# Altium schematic sheet Battery.SchDoc
size A4
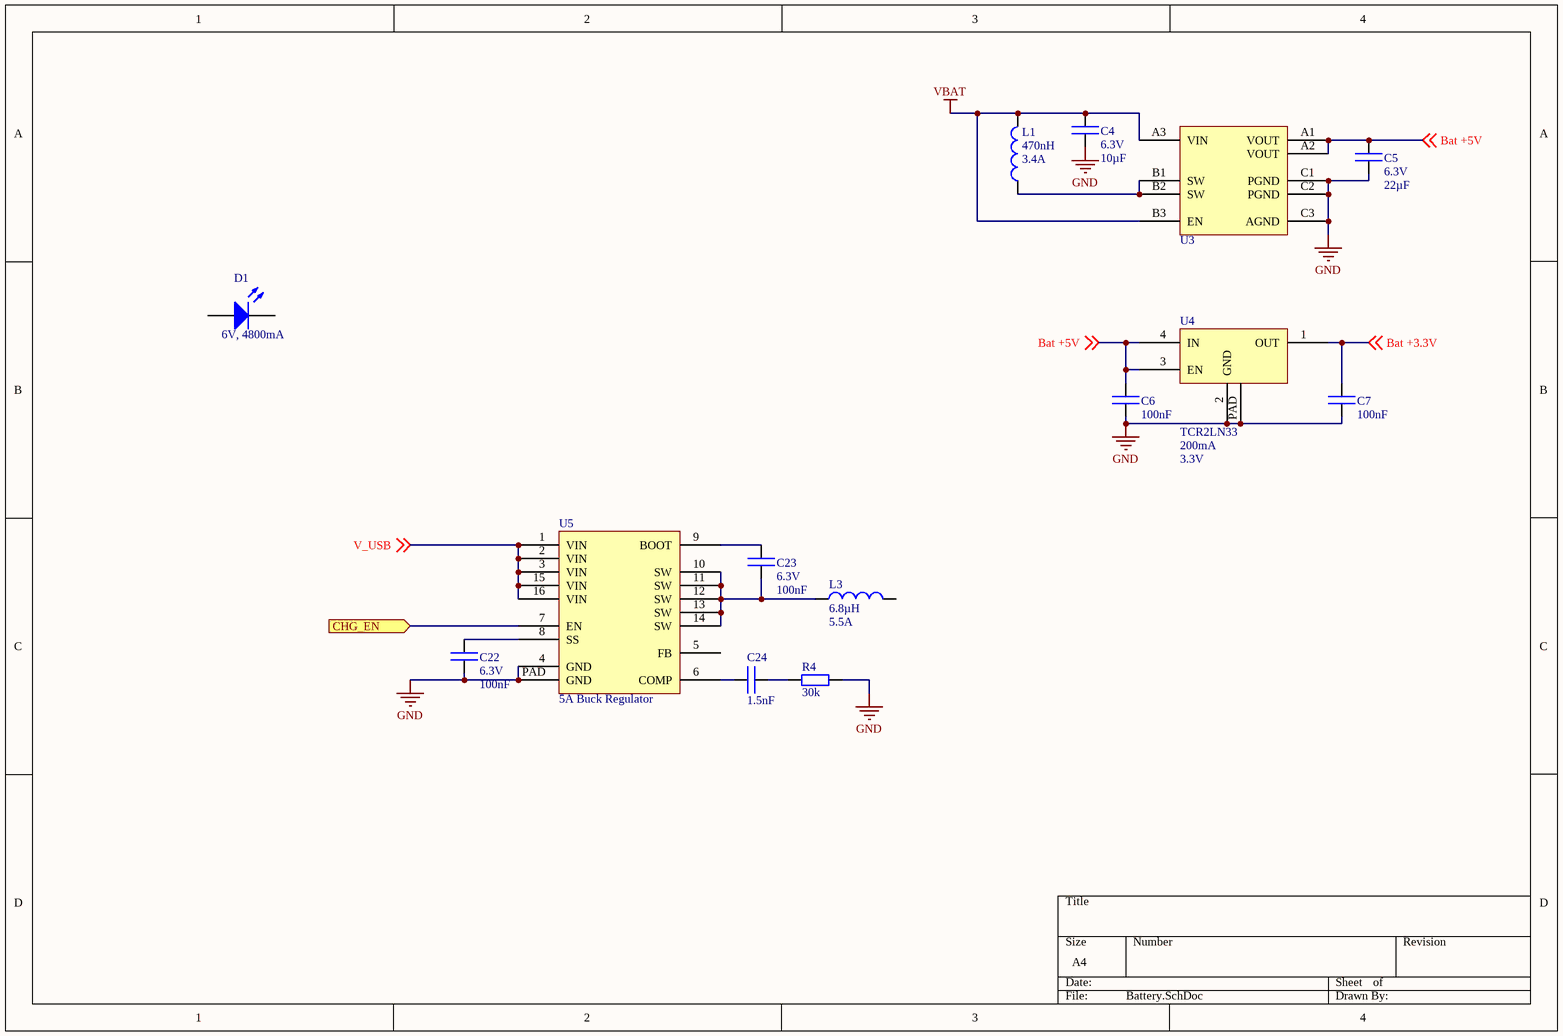
[diagram p0: Battery.SchDoc]

## Parts
C4  Voltage: 6.3V  Capacity: 10µF  [0402 (C)]  (hidden comment: Cap 10µF)
C5  VOLTAGE: 6.3V  CAPACITY: 22µF  [0603 (C)]  (hidden comment: Cap 22µF)
C6  Capacity: 100nF  [0201 (C)]  (hidden comment: Cap 100nF)
C7  Capacity: 100nF  [0201 (C)]  (hidden comment: Cap 100nF)
C22  Voltage: 6.3V  Capacity: 100nF  [0201 (C)]  (hidden comment: Cap 100nF)
C23  Voltage: 6.3V  Capacity: 100nF  [0201 (C)]  (hidden comment: Cap 100nF)
C24  Capacity: 1.5nF  [0201 (C)]  (hidden comment: Cap 1.5nF)
D1  specs: 6V, 4800mA  [XHP70 6V Slot]  (hidden comment: XHP70)
L1  value 470nH  Current: 3.4A  [0806 (L)]  (hidden comment: L 470nH)
L3  value 6.8µH  Rated Current: 5.5A  [Inductor (8.4mm x 7.9mm)]  (hidden comment: L 6.8µH)
R4  value 30k  [0603 (R)]  (hidden comment: Res 30k)
U3  FAN48610UC50X  [WLCSP-6 (1.2mm x 1.2mm)]  (value not drawn)
U4  TCR2LN33  Current: 200mA  Output Voltage: 3.3V  [SDFN-4 (0.8mm x 0.8mm)]
U5  5A Buck Regulator  [WQFN-16 (3mm x 3mm)]

## Ports
CHG_EN (in)

## Nets
GND: C4.2 C5.2 C6.2 C7.2 C22.1 R4.2 U3.C1(PGND) U3.C2(PGND) U3.C3(AGND) U4.2(GND) U4.PAD U5.4(GND) U5.PAD(GND)
VBAT: C4.1 L1.2 U3.A3(VIN) U3.B3(EN)
Bat +3.3V: C7.1 U4.1(OUT) ; off-sheet Bat +3.3V
Bat +5V: C5.1 C6.1 U3.A1(VOUT) U3.A2(VOUT) U4.3(EN) U4.4(IN) ; off-sheet Bat +5V
CHG_EN: U5.7(EN) ; port CHG_EN
V_USB: U5.1(VIN) U5.2(VIN) U5.3(VIN) U5.15(VIN) U5.16(VIN) ; off-sheet V_USB
NetC22_2: C22.2 U5.8(SS)
NetC23_1: C23.1 L3.1 U5.10(SW) U5.11(SW) U5.12(SW) U5.13(SW) U5.14(SW)
NetC23_2: C23.2 U5.9(BOOT)
NetC24_1: C24.1 R4.1
NetC24_2: C24.2 U5.6(COMP)
NetL1_1: L1.1 U3.B1(SW) U3.B2(SW)

Not connected (* = marked no-connect by the designer): D1 1(A) 2(K); L3 2; U5 5(FB)

## Library data of the parts
C4 = Cap 10µF: Ceramic Capacitor 10µF
C5 = Cap 22µF: Ceramic Capacitor 22µF
C6 C7 = Cap 100nF: Ceramic Capacitor 100nF; Voltage: 25V
C22 C23 = Cap 100nF: Ceramic Capacitor 100nF
C24 = Cap 1.5nF: Ceramic Capacitor 1.5nF; Voltage: 25V
D1 = XHP70: High Power LED; Color: White; Supplier 1: Digi-Key; Supplier Part Number 1: XHP70A-01-0000-0D0BN20E1CT-ND
L1 = L 470nH: Inductor 470nH; Digi-Key: 490-10606-1-ND
L3 = L 6.8µH: Inductor 6.8µH; Saturation Current: 7.5A; DC Resistance: 23.3mOhm; Digi-Key: 732-4182-1-ND
R4 = Res 30k: Resistor 30k; Published: 8-Jun-2000; LatestRevisionDate: 17-Jul-2002; LatestRevisionNote: Re-released for DXP Platform.; PackageReference: AXIAL-0.4; Publisher: Altium Limited; PackageDescription: Axial Device, Thru-Hole; 2 Leads; 0.4 in Pin Spacing
U3 = FAN48610UC50X: Boost Regulator 5V
U4 = TCR2LN33: Low Dropout Regulator 3.3V, 200mA; Manufacturer: Toshiba; Input Voltage: 3.5V...5.5V; Digi-Key: TCR2LN33LFCT-ND
U5 = RT8251: Input Voltage: 4.75V - 24V; Output Voltage: 0.8V - 15V; Switching Frequency: 570kHz; Max Current (Continuous): 5A